# Altium project balancerTest.PrjPCB
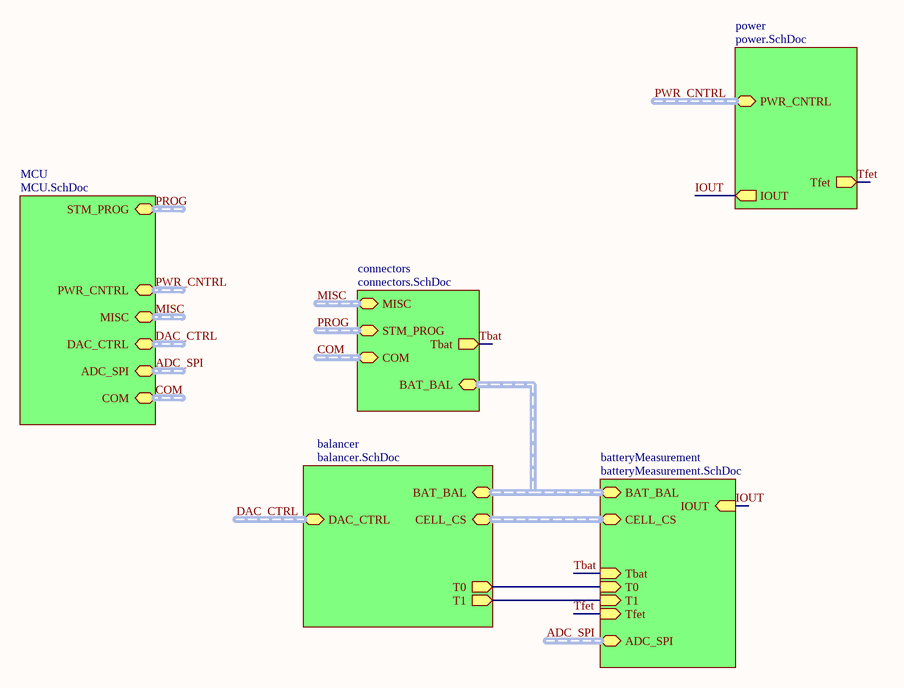
[diagram p0: balancerTest.SchDoc]
6 sheets, 158 parts. Net scope: hierarchical (ports join the sheet entries above them; power ports are global).
Board file: smart_bms.PcbDoc
Sheets:
  balancerTest.SchDoc
    MCU = MCU.SchDoc
    connectors = connectors.SchDoc
    balancer = balancer.SchDoc
    power = power.SchDoc
    batteryMeasurement = batteryMeasurement.SchDoc

## Sheet balancerTest.SchDoc
size A4

### Sub-sheets
balancer = balancer.SchDoc: BAT_BAL (harness BAT_BAL), CELL_CS (harness CELL_CS), DAC_CTRL (harness DAC_CTRL), T0 (out), T1 (out)
batteryMeasurement = batteryMeasurement.SchDoc: BAT_BAL (harness BAT_BAL), CELL_CS (harness CELL_CS), ADC_SPI (harness ADC_SPI), T0 (in), T1 (in), Tbat (in), IOUT (in), Tfet (in)
connectors = connectors.SchDoc: BAT_BAL (harness BAT_BAL), Tbat (out), MISC (harness MISC), STM_PROG (harness PROGRAMMING), COM (harness COM)
MCU = MCU.SchDoc: MISC (harness MISC), DAC_CTRL (harness DAC_CTRL), ADC_SPI (harness ADC_SPI), PWR_CNTRL (harness PWR_CNTRL), STM_PROG (harness PROGRAMMING), COM (harness COM)
power = power.SchDoc: IOUT (out), Tfet (out), PWR_CNTRL (harness PWR_CNTRL)

### Nets
IOUT: sheet power/IOUT, sheet batteryMeasurement/IOUT
Tbat: sheet connectors/Tbat, sheet batteryMeasurement/Tbat
Tfet: sheet power/Tfet, sheet batteryMeasurement/Tfet
NetRA4_5: sheet balancer/T1, sheet batteryMeasurement/T1
NetRA4_6: sheet balancer/T0, sheet batteryMeasurement/T0

### Buses and harness runs
harness ADC_SPI = sheet batteryMeasurement/ADC_SPI
harness ADC_SPI = sheet MCU/ADC_SPI
harness COM = sheet connectors/COM
harness COM = sheet MCU/COM
harness DAC_CTRL = sheet balancer/DAC_CTRL
harness DAC_CTRL = sheet MCU/DAC_CTRL
harness MISC = sheet connectors/MISC
harness MISC = sheet MCU/MISC
harness PROG = sheet connectors/STM_PROG
harness PROG = sheet MCU/STM_PROG
harness PWR_CNTRL = sheet MCU/PWR_CNTRL
harness PWR_CNTRL = sheet power/PWR_CNTRL
harness sheet balancer/BAT_BAL = sheet batteryMeasurement/BAT_BAL = sheet connectors/BAT_BAL
harness sheet balancer/CELL_CS = sheet batteryMeasurement/CELL_CS

## Sheet MCU.SchDoc
size A4
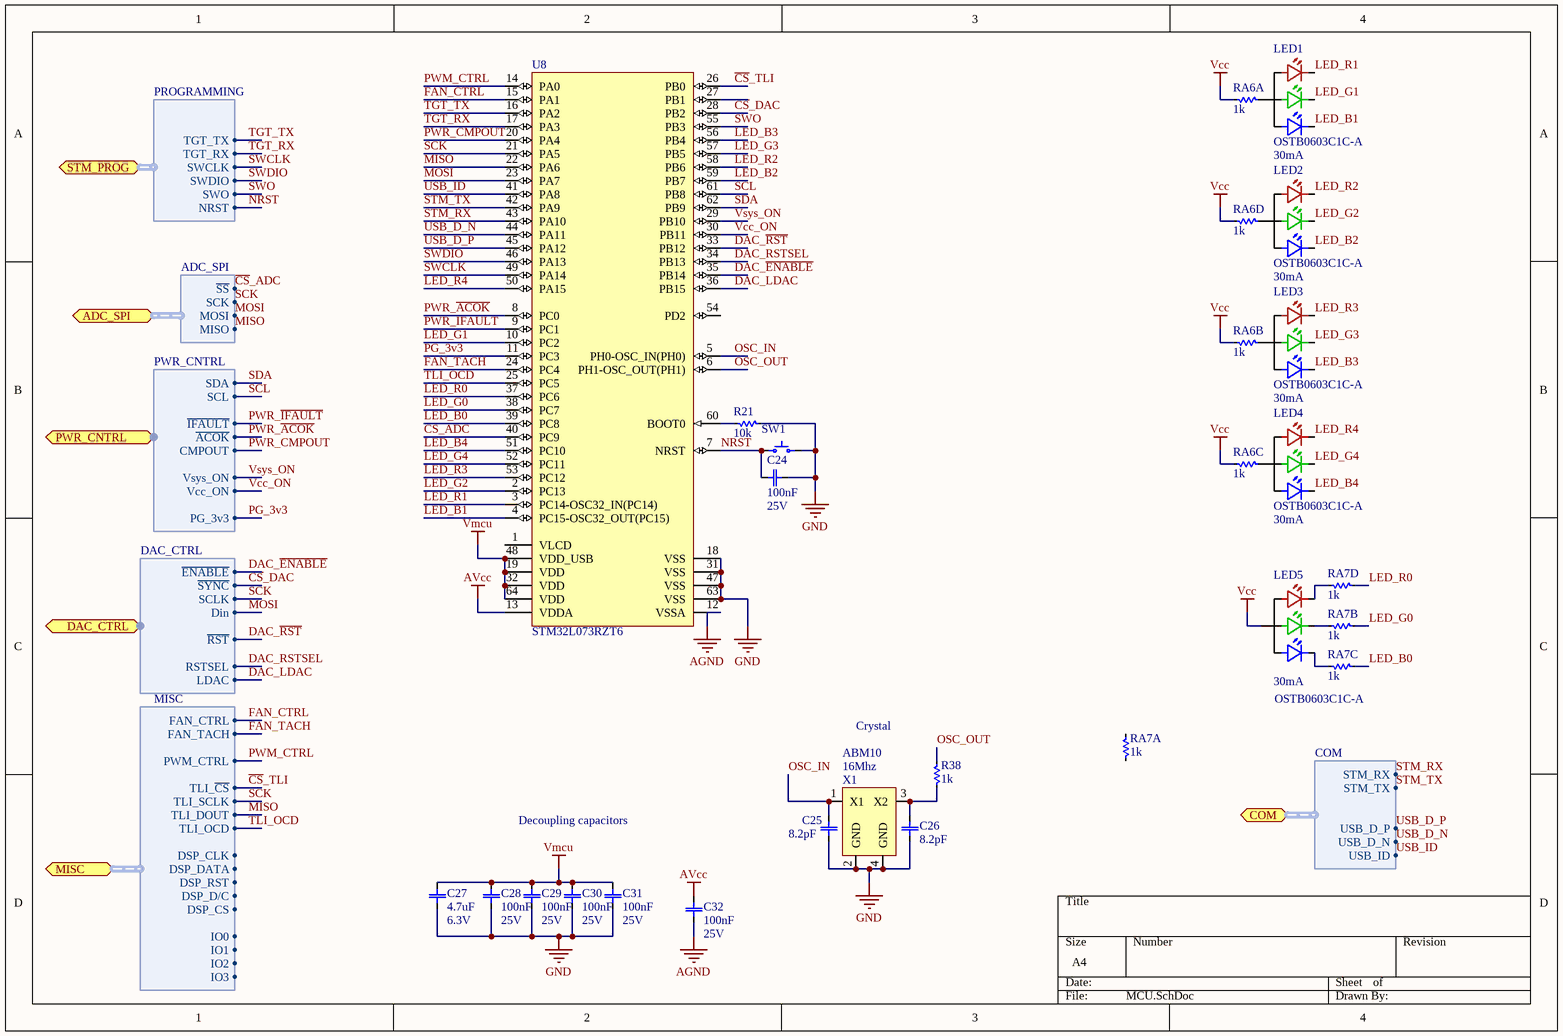
[diagram p1: MCU.SchDoc]

### Parts
C24  Capacitance: 100nF  [CAP0402]  (hidden comment: 25V)
C25  Capacitance: 8.2pF  [CAP0402]  (hidden comment: 25V)
C26  Capacitance: 8.2pF  [CAP0402]  (hidden comment: 25V)
C27  Capacitance: 4.7uF  [CAP0603]  (hidden comment: 6.3V)
C28  Capacitance: 100nF  [CAP0402]  (hidden comment: 25V)
C29  Capacitance: 100nF  [CAP0402]  (hidden comment: 25V)
C30  Capacitance: 100nF  [CAP0402]  (hidden comment: 25V)
C31  Capacitance: 100nF  [CAP0402]  (hidden comment: 25V)
C32  Capacitance: 100nF  [CAP0402]  (hidden comment: 25V)
LED1  OSTB0603C1C-A  Forward current: 30mA  [LED-RGB-1615-CA-OSTB0603C1C-A]
LED2  OSTB0603C1C-A  Forward current: 30mA  [LED-RGB-1615-CA-OSTB0603C1C-A]
LED3  OSTB0603C1C-A  Forward current: 30mA  [LED-RGB-1615-CA-OSTB0603C1C-A]
LED4  OSTB0603C1C-A  Forward current: 30mA  [LED-RGB-1615-CA-OSTB0603C1C-A]
LED5  OSTB0603C1C-A  Forward current: 30mA  [LED-RGB-1615-CA-OSTB0603C1C-A]
R21  Resistance: 10k  [RES0402]  (hidden comment: resistor)
R38  Resistance: 1k  [RES0402]  (hidden comment: resistor)
RA6  Resistance: 1k  [CAC-50P200X100-8L]  (hidden comment: quad_resistor)  (parts A,B,C,D of 4)
RA7  Resistance: 1k  [CAC-50P200X100-8L]  (hidden comment: quad_resistor)  (parts A,B,C,D of 4)
SW1  SPST_PUSHBUTTON  [B3U-1000P]  (value not drawn)
U8  STM32L073RZT6  [STM-LQFP64_N]
X1  ABM10  Frequency: 16Mhz  [XTAL-2.5x2.0]

### Ports
ADC_SPI (harness ADC_SPI), COM (harness COM), DAC_CTRL (harness DAC_CTRL), MISC (harness MISC), PWR_CNTRL (harness PWR_CNTRL), STM_PROG (harness PROGRAMMING)

### Harnesses
ADC_SPI: SCK, MOSI, MISO, ~{SS}
PWR_CNTRL: SDA, SCL, ~{ACOK}, ~{IFAULT}, CMPOUT, Vsys_ON, Vcc_ON, PG_3v3
DAC_CTRL: ~{ENABLE}, ~{SYNC}, SCLK, Din, ~{RST}, RSTSEL, LDAC
MISC: FAN_CTRL, PWM_CTRL, FAN_TACH, DSP_CLK, DSP_DATA, DSP_RST, DSP_D/C, DSP_CS, TLI_~{CS}, TLI_SCLK, TLI_DOUT, TLI_OCD, IO0, IO1, IO2, IO3
PROGRAMMING: NRST, SWDIO, SWCLK, TGT_RX, TGT_TX, SWO
COM: STM_RX, STM_TX, USB_D_P, USB_D_N, USB_ID

### Nets
AGND: C24.2 C25.1 C26.1 C27.1 C28.2 C29.2 C30.2 C31.2 C32.2 R21.2 SW1.2 U8.12(VSSA) U8.18(VSS) U8.31(VSS) U8.47(VSS) U8.63(VSS) X1.2(GND) X1.4(GND)  [also labelled GND]
AVcc: C32.1 U8.13(VDDA)
Vcc: LED5.A RA6.5 RA6.6 RA6.7 RA6.8
Vmcu: C27.2 C28.1 C29.1 C30.1 C31.1 U8.19(VDD) U8.32(VDD) U8.48(VDD_USB) U8.64(VDD)
~{CS}_ADC: U8.40(PC9) ; port ADC_SPI.~{SS}  [project net ADC_SPI.~{SS}]
~{CS}_DAC: U8.28(PB2) ; port DAC_CTRL.~{SYNC}
~{CS}_TLI: U8.26(PB0) ; port MISC.TLI_~{CS}
DAC_~{ENABLE}: U8.35(PB14) ; port DAC_CTRL.~{ENABLE}  [project net DAC_CTRL.~{ENABLE}]
DAC_LDAC: U8.36(PB15) ; port DAC_CTRL.LDAC  [project net DAC_CTRL.LDAC]
DAC_~{RST}: U8.33(PB12) ; port DAC_CTRL.~{RST}  [project net DAC_CTRL.~{RST}]
DAC_RSTSEL: U8.34(PB13) ; port DAC_CTRL.RSTSEL  [project net DAC_CTRL.RSTSEL]
FAN_CTRL: U8.15(PA1) ; port MISC.FAN_CTRL
FAN_TACH: U8.24(PC4) ; port MISC.FAN_TACH
LED_B0: RA7.5 U8.39(PC8)
LED_B1: LED1.B(Blue) U8.4(PC15-OSC32_OUT(PC15))
LED_B2: LED2.B(Blue) U8.59(PB7)
LED_B3: LED3.B(Blue) U8.56(PB4)
LED_B4: LED4.B(Blue) U8.51(PC10)
LED_G0: RA7.6 U8.38(PC7)
LED_G1: LED1.G(Green) U8.10(PC2)
LED_G2: LED2.G(Green) U8.2(PC13)
LED_G3: LED3.G(Green) U8.57(PB5)
LED_G4: LED4.G(Green) U8.52(PC11)
LED_R0: RA7.7 U8.37(PC6)
LED_R1: LED1.R(Red) U8.3(PC14-OSC32_IN(PC14))
LED_R2: LED2.R(Red) U8.58(PB6)
LED_R3: LED3.R(Red) U8.53(PC12)
LED_R4: LED4.R(Red) U8.50(PA15)
MISO: U8.22(PA6) ; port ADC_SPI.MISO, port MISC.TLI_DOUT  [project net ADC_SPI.MISO]
MOSI: U8.23(PA7) ; port ADC_SPI.MOSI, port DAC_CTRL.Din  [project net ADC_SPI.MOSI]
NRST: C24.1 SW1.1 U8.7(NRST) ; port STM_PROG.NRST
OSC_IN: C25.2 U8.5(PH0-OSC_IN(PH0)) X1.1(X1)
OSC_OUT: R38.2 U8.6(PH1-OSC_OUT(PH1))
PG_3v3: U8.11(PC3) ; port PWR_CNTRL.PG_3v3
PWM_CTRL: U8.14(PA0) ; port MISC.PWM_CTRL  [project net MISC.PWM_CTRL]
PWR_~{ACOK}: U8.8(PC0) ; port PWR_CNTRL.~{ACOK}  [project net ~{ACOK}]
PWR_CMPOUT: U8.20(PA4) ; port PWR_CNTRL.CMPOUT  [project net CMPOUT]
PWR_~{IFAULT}: U8.9(PC1) ; port PWR_CNTRL.~{IFAULT}  [project net ~{IFAULT}]
SCK: U8.21(PA5) ; port ADC_SPI.SCK, port DAC_CTRL.SCLK, port MISC.TLI_SCLK  [project net ADC_SPI.SCK]
SCL: U8.61(PB8) ; port PWR_CNTRL.SCL  [project net PWR_CNTRL.SCL]
SDA: U8.62(PB9) ; port PWR_CNTRL.SDA  [project net PWR_CNTRL.SDA]
STM_RX: U8.43(PA10) ; port COM.STM_RX  [project net COM.STM_RX]
STM_TX: U8.42(PA9) ; port COM.STM_TX  [project net COM.STM_TX]
SWCLK: U8.49(PA14) ; port STM_PROG.SWCLK  [project net PROG.SWCLK]
SWDIO: U8.46(PA13) ; port STM_PROG.SWDIO  [project net PROG.SWDIO]
SWO: U8.55(PB3) ; port STM_PROG.SWO  [project net PROG.SWO]
TGT_RX: U8.17(PA3) ; port STM_PROG.TGT_RX  [project net PROG.TGT_RX]
TGT_TX: U8.16(PA2) ; port STM_PROG.TGT_TX  [project net PROG.TGT_TX]
TLI_OCD: U8.25(PC5) ; port MISC.TLI_OCD  [project net MISC.TLI_OCD]
USB_D_N: U8.44(PA11) ; port COM.USB_D_N  [project net COM.USB_D_N]
USB_D_P: U8.45(PA12) ; port COM.USB_D_P  [project net COM.USB_D_P]
USB_ID: U8.41(PA8) ; port COM.USB_ID  [project net COM.USB_ID]
Vcc_ON: U8.30(PB11) ; port PWR_CNTRL.Vcc_ON  [project net PWR_CNTRL.Vcc_ON]
Vsys_ON: U8.29(PB10) ; port PWR_CNTRL.Vsys_ON  [project net PWR_CNTRL.Vsys_ON]
NetC26_2: C26.2 R38.1 X1.3(X2)
NetLED1_A: LED1.A RA6.1
NetLED2_A: LED2.A RA6.2
NetLED3_A: LED3.A RA6.3
NetLED4_A: LED4.A RA6.4
NetLED5_B: LED5.B(Blue) RA7.4
NetLED5_G: LED5.G(Green) RA7.3
NetLED5_R: LED5.R(Red) RA7.2
NetR21_1: R21.1 U8.60(BOOT0)

Not connected (* = marked no-connect by the designer): RA7 1 8; U8 1(VLCD) 27(PB1) 54(PD2)

### Notes on the sheet
- Crystal
- Decoupling capacitors

### Library data of the parts
C24-C32 = capacitor: Tolerance: 10%; Dielectric: X5R
  C24-C26 C28-C32: Voltage: 25V
  C27: Voltage: 6.3V
LED1-LED5 = RGB-LED-CA: pin to pad: A>1 B>3 G>4 R>2; Vred: 2.0V; Vgreen: 2.6V; Vblue: 2.8V
R21 R38 = resistor: Power: 0.063W; Tolerance: 1%
SW1 = SPST_PUSHBUTTON: Standard 2-contact pushbutton; Max voltage: 24V; Max current: 50mA
U8 = CMP-1546-00073-1: Ultra-Low-Power ARM Cortex-M0+ MCU, 192 KB Flash, 20 KB Internal RAM, 51 I/Os, 64-Pin LQFP, -40 to 85 degC, Tray; Internal RAM Size (kB): 20; Data E2PROM nom (B): 6144; FLASH Size (Prog) (kB): 192; Operating Frequency(F) (Processor speed) (MHz): 32; D/A Converter: 2; I/Os (High Current): 51; Supply Voltage(Vcc) min (V): 1.8; ComponentLink1Description: Manufacturer URL; ComponentLink2Description: Datasheet; DatasheetVersion: Rev. 2; Mounting Technology: Surface Mount; Package Description: 64-Pin Low-profile Quad Flat Package, Body 10 x 10 mm, Pitch 0.5 mm; ComponentLink2URL: http://www.st.com/st-web-ui/static/active/en/resource/technical/document/datasheet/DM00141036.pdf; Core: ARM Cortex-M0+; Packing: Tray; ComponentLink1URL: http://www.st.com/; Package Reference: LQFP64
X1 = XTAL-4pin: 4pin crystal with 2 GND pins; Stability: 20ppm; Load capacitance: 10pF; Shunt capacitance: 7pF

## Sheet connectors.SchDoc
size A4
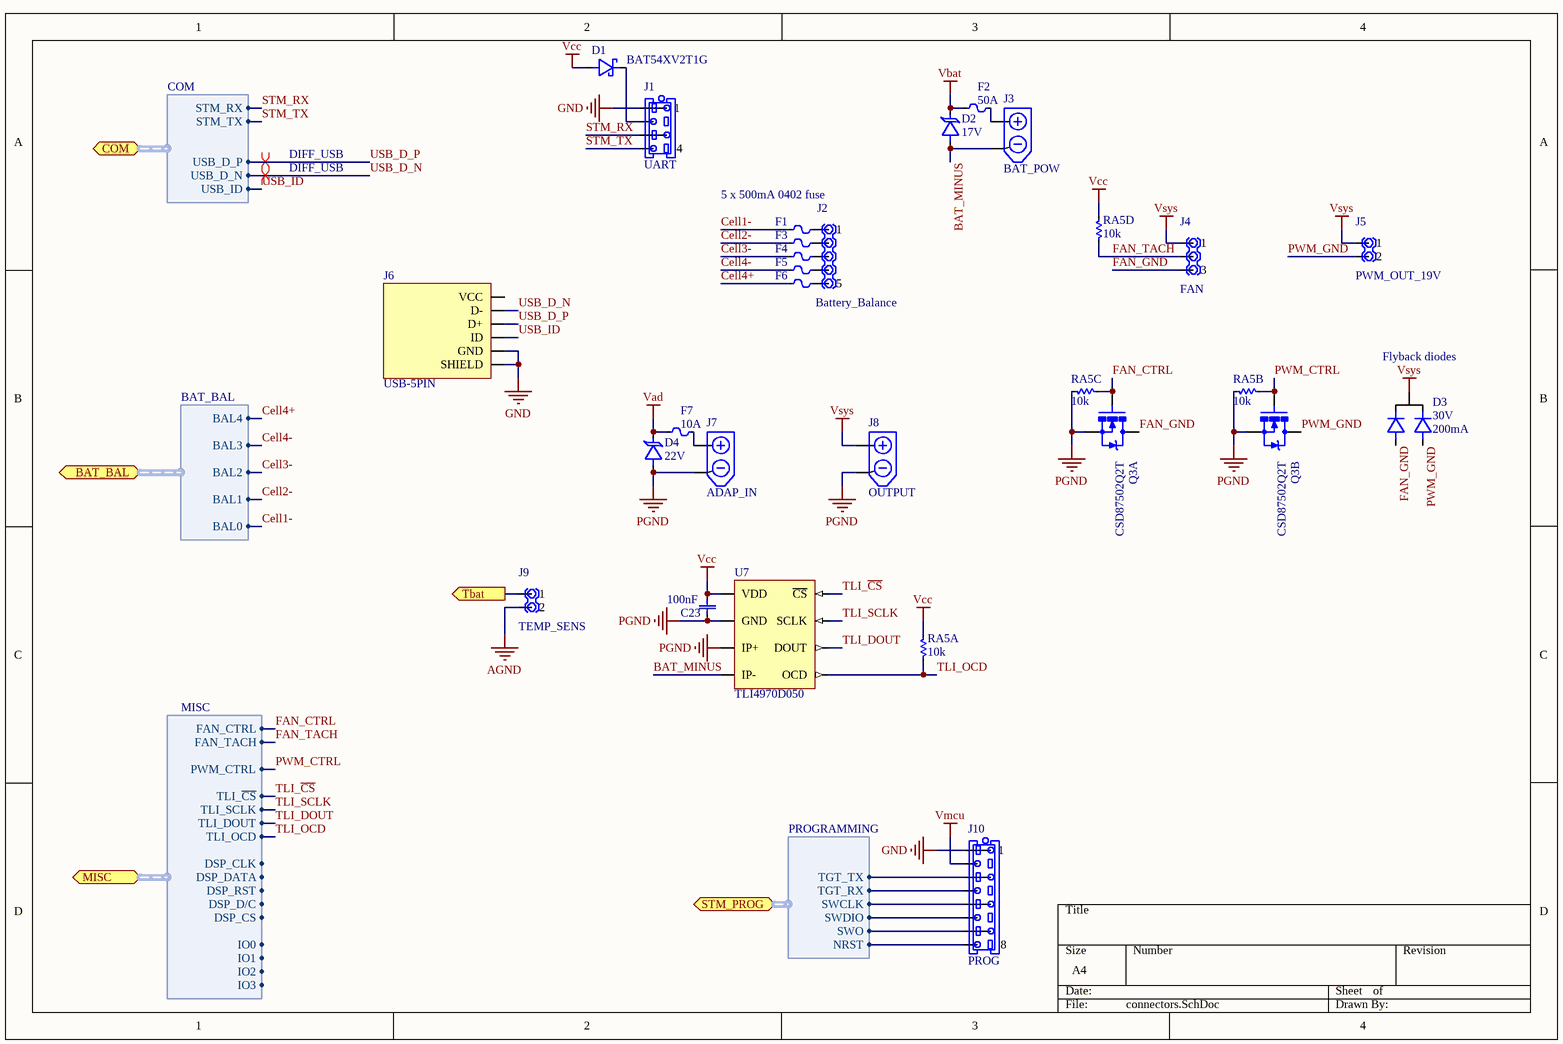
[diagram p2: connectors.SchDoc]

### Parts
C23  Capacitance: 100nF  [CAP0402]  (hidden comment: 0nF)
D1  BAT54XV2T1G  [SOD523]
D2  Reverse stand-off voltage: 17V  [SOD123W]  (hidden comment: PTVS17VS1UR)
D3  Reverse voltage: 30V  Forward current: 200mA  [SOT65P210X110-3L]  (hidden comment: BAT54CWT1G)
D4  Reverse stand-off voltage: 22V  [SOD123W]  (hidden comment: PTVS22VS1UR)
F1  fuse  [FUSE-0402]  (value not drawn)
F2  Rated current: 50A  [FUSE-1206]  (hidden comment: fuse)
F3  fuse  [FUSE-0402]  (value not drawn)
F4  fuse  [FUSE-0402]  (value not drawn)
F5  fuse  [FUSE-0402]  (value not drawn)
F6  fuse  [FUSE-0402]  (value not drawn)
F7  Rated current: 10A  [FUSE-1206]  (hidden comment: fuse)
J1  UART  [MICRO-MATCH-4]
J2  Battery_Balance  [JST-XH-5-TOP]
J3  BAT_POW  [XT60_male]
J4  FAN  [Pin Header 1x3 TH Pitch 2.54mm]
J5  PWM_OUT_19V  [Pin Header 1x2 TH Pitch 2.54mm]
J6  USB-5PIN  [USB-B-MICRO-473460001]
J7  ADAP_IN  [XT60_male]
J8  OUTPUT  [XT60_male]
J9  TEMP_SENS  [Pin Header 1x2 TH Pitch 2.54mm]
J10  PROG  [MICRO-MATCH-8]
Q3  CSD87502Q2T  [SON65P200X80_HS-7L_DUALFET]  (parts A,B of 2)
RA5  Resistance: 10k  [CAC-50P200X100-8L]  (hidden comment: quad_resistor)  (parts A,B,C,D of 4)
U7  TLI4970D050  [PG-TISON-8-1]

### Ports
BAT_BAL (harness BAT_BAL), COM (harness COM), MISC (harness MISC), STM_PROG (harness PROGRAMMING), Tbat (out)

### Harnesses
BAT_BAL: BAL0, BAL1, BAL2, BAL3, BAL4
MISC: FAN_CTRL, PWM_CTRL, FAN_TACH, DSP_CLK, DSP_DATA, DSP_RST, DSP_D/C, DSP_CS, IO0, TLI_~{CS}, TLI_SCLK, TLI_DOUT, TLI_OCD, IO1, IO2, IO3
PROGRAMMING: NRST, SWDIO, SWCLK, TGT_RX, TGT_TX, SWO
COM: STM_RX, STM_TX, USB_D_P, USB_D_N, USB_ID

### Nets
AGND: J1.1 J6.5(GND) J6.6(SHIELD) J9.2 J10.1  [also labelled GND]
PGND: C23.1 D4.A(Anode) J7.1(-) J8.1(-) Q3.S1 Q3.S2 RA5.5 RA5.6 U7.1(GND) U7.7(IP+)
Vad: D4.C(Cathode) F7.1
Vbat: D2.C(Cathode) F2.1  [project net SRN]
Vcc: C23.2 D1.A(Anode) RA5.7 RA5.8 U7.2(VDD)
Vmcu: J10.2
Vsys: D3.C(Cathode) J4.1 J5.1 J8.2(+)
BAT_MINUS: D2.A(Anode) J3.1(-) U7.8(IP-)
Cell1-: F1.1 ; port BAT_BAL.BAL0
Cell2-: F3.1 ; port BAT_BAL.BAL1
Cell3-: F4.1 ; port BAT_BAL.BAL2
Cell4+: F6.1 ; port BAT_BAL.BAL4
Cell4-: F5.1 ; port BAT_BAL.BAL3
FAN_CTRL: Q3.G1 RA5.4 ; port MISC.FAN_CTRL
FAN_GND: D3.A1(Anode1) J4.3 Q3.D1
FAN_TACH: J4.2 RA5.2 ; port MISC.FAN_TACH
NRST: J10.8 ; port STM_PROG.NRST
PROG.SWCLK: J10.5 ; port STM_PROG.SWCLK
PROG.SWDIO: J10.6 ; port STM_PROG.SWDIO
PROG.SWO: J10.7 ; port STM_PROG.SWO
PROG.TGT_RX: J10.4 ; port STM_PROG.TGT_RX
PROG.TGT_TX: J10.3 ; port STM_PROG.TGT_TX
PWM_CTRL: Q3.G2 RA5.3 ; port MISC.PWM_CTRL  [project net MISC.PWM_CTRL]
PWM_GND: D3.A2(Anode2) J5.2 Q3.D2
STM_RX: J1.3 ; port COM.STM_RX  [project net COM.STM_RX]
STM_TX: J1.4 ; port COM.STM_TX  [project net COM.STM_TX]
Tbat: J9.1 ; port Tbat
TLI_~{CS}: U7.5(~{CS}) ; port MISC.TLI_~{CS}  [project net ~{CS}_TLI]
TLI_DOUT: U7.3(DOUT) ; port MISC.TLI_DOUT  [project net ADC_SPI.MISO]
TLI_OCD: RA5.1 U7.6(OCD) ; port MISC.TLI_OCD  [project net MISC.TLI_OCD]
TLI_SCLK: U7.4(SCLK) ; port MISC.TLI_SCLK  [project net ADC_SPI.SCK]
USB_D_N: J6.2(D-) ; port COM.USB_D_N  [project net COM.USB_D_N]
USB_D_P: J6.3(D+) ; port COM.USB_D_P  [project net COM.USB_D_P]
USB_ID: J6.4(ID) ; port COM.USB_ID  [project net COM.USB_ID]
NetD1_C: D1.C(Cathode) J1.2
NetF1_2: F1.2 J2.1
NetF2_2: F2.2 J3.2(+)
NetF3_2: F3.2 J2.2
NetF4_2: F4.2 J2.3
NetF5_2: F5.2 J2.4
NetF6_2: F6.2 J2.5
NetF7_2: F7.2 J7.2(+)

Not connected (* = marked no-connect by the designer): J6 1(VCC)

### Layout directives
differential pair; net class DIFF_USB: COM.USB_D_N, COM.USB_D_P

### Notes on the sheet
- 5 x 500mA 0402 fuse
- (near D3) Flyback diodes

### Library data of the parts
C23 = capacitor: Max voltage: 25V; Tolerance: 10%
D1 = Schottky diode: Peak forward current: 1A; Max forward voltage: 0.5V; Reverse voltage: 30V; Forward current: 200mA
D2 = TVS-DIODE: Peak pulse power dissipation: 400W; Clamping voltage: 27.6
D3 = DUAL-DIODE-CC: pin to pad: A1>1 A2>2 C>3; Peak forward current: 600mA; Max forward voltage: 0.5V
D4 = TVS-DIODE: Peak pulse power dissipation: 400W; Clamping voltage: 35.5V
F1 F3-F6 = fuse: Power: 0.063W; Rated voltage DC: 24V; Blow characteristic: Slow blow; Rated voltage AC: 12V; Breaking current: 2A; Rated current: 500mA
F2 F7 = fuse: Power: 0.063W; Rated voltage DC: 24V; Blow characteristic: Slow blow; Rated voltage AC: 12V; Breaking current: 2A
J1 = MICRO-MATCH-4
J2 = HEADER-5
J3 J7 J8 = XT60
J4 = HEADER-3
J5 J9 = HEADER-2
J6 = USB-5PIN: pin to pad: 6>SHLD
J10 = MICRO-MATCH-8
Q3 = DUAL-NFET: PROD_ID: IC-08089
U7 = TLI4970: High precision miniature coreless magnetic current sensor for AC and DC  measurements with digital interface and fast overcurrent detection; Measurement range: ±50A

## Sheet balancer.SchDoc
size A4
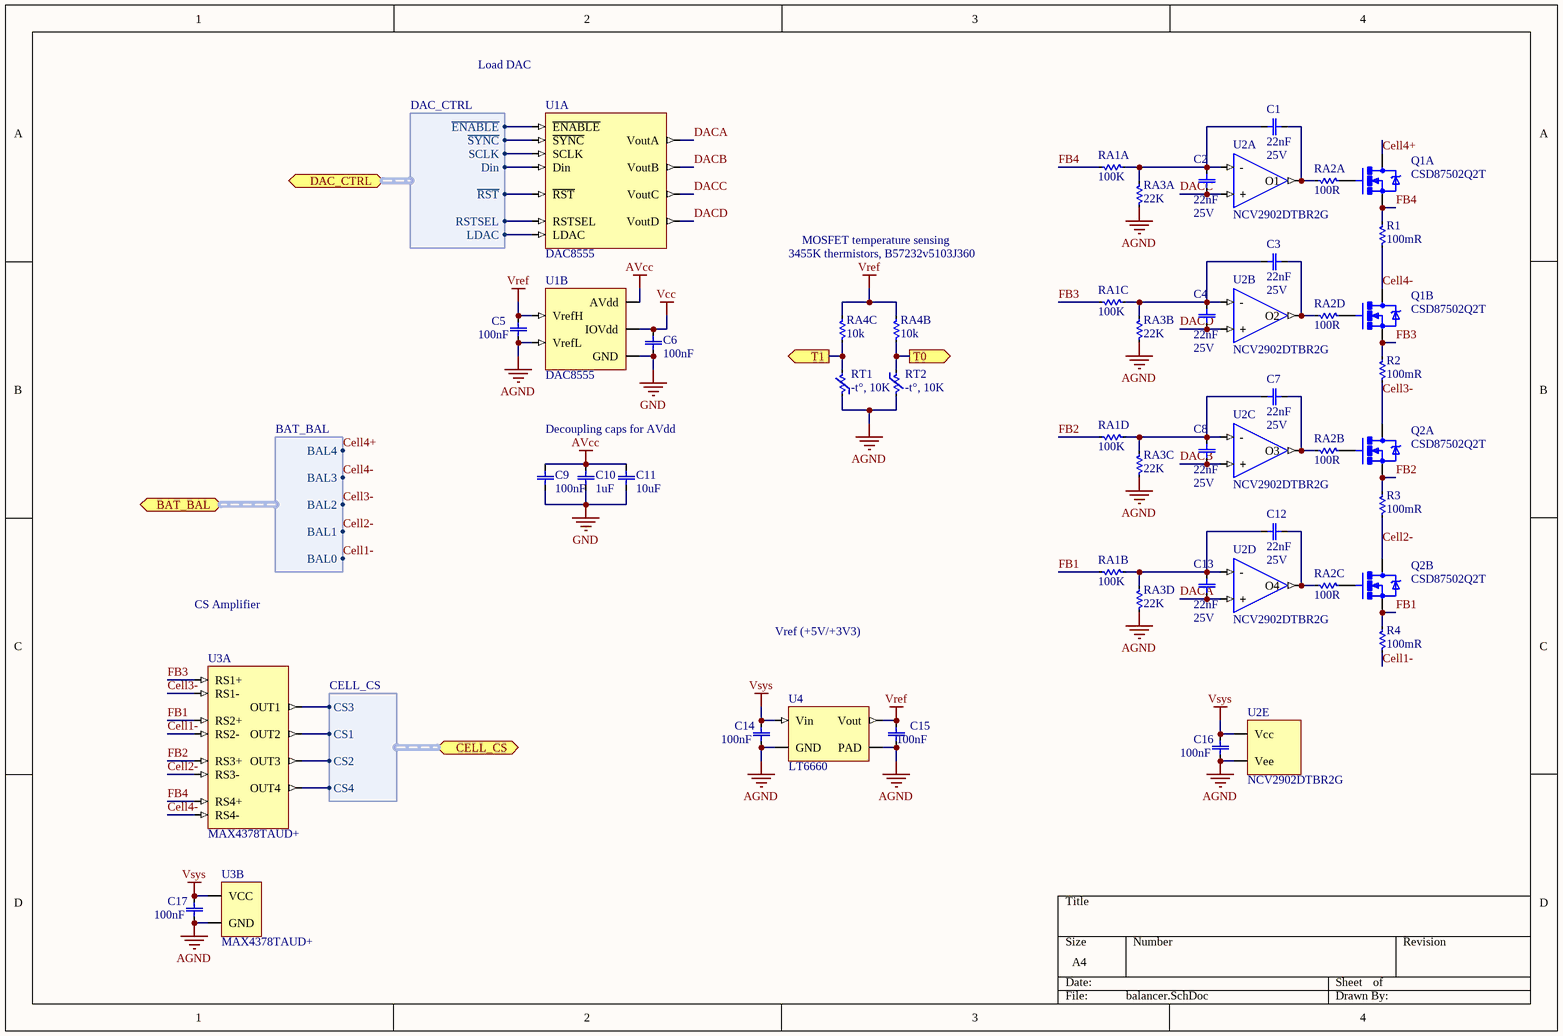
[diagram p3: balancer.SchDoc]

### Parts
C1  Capacitance: 22nF  [CAP0402]  (hidden comment: 25V)
C2  Capacitance: 22nF  [CAP0402]  (hidden comment: 25V)
C3  Capacitance: 22nF  [CAP0402]  (hidden comment: 25V)
C4  Capacitance: 22nF  [CAP0402]  (hidden comment: 25V)
C5  100nF  [CAP0402]
C6  100nF  [CAP0402]
C7  Capacitance: 22nF  [CAP0402]  (hidden comment: 25V)
C8  Capacitance: 22nF  [CAP0402]  (hidden comment: 25V)
C9  100nF  [CAP0402]
C10  1uF  [CAP0603]
C11  10uF  [CAP0603]
C12  Capacitance: 22nF  [CAP0402]  (hidden comment: 25V)
C13  Capacitance: 22nF  [CAP0402]  (hidden comment: 25V)
C14  100nF  [CAP0402]
C15  100nF  [CAP0402]
C16  100nF  [CAP0402]
C17  100nF  [CAP0402]
Q1  CSD87502Q2T  [SON65P200X80_HS-7L_DUALFET]  (parts A,B of 2)
Q2  CSD87502Q2T  [SON65P200X80_HS-7L_DUALFET]  (parts A,B of 2)
R1  100mR  [RES0402]
R2  100mR  [RES0402]
R3  100mR  [RES0402]
R4  100mR  [RES0402]
RA1  100K  [CAC-80P319X159-8M]  (parts A,B,C,D of 4)
RA2  100R  [CAC-50P200X100-8L]  (parts A,B,C,D of 4)
RA3  22K  [CAC-80P319X159-8M]  (parts A,B,C,D of 4)
RA4  Resistance: 10k  [CAC-50P200X100-8L]  (hidden comment: quad_resistor)  (parts B,C of 4)
RT1  -t°, 10K  [RES0402]
RT2  -t°, 10K  [RES0402]
U1  DAC8555  [TSOP65P640X120-16L]  (parts A,B of 2)
U2  NCV2902DTBR2G  [TSOP65P640X120-14L]  (parts A,B,C,D,E of 5)
U3  MAX4378TAUD+  [TSOP65P640X120-14L]  (parts A,B of 2)
U4  LT6660  [DFN50P200X200X75_4L_EP]

### Ports
BAT_BAL (harness BAT_BAL), CELL_CS (harness CELL_CS), DAC_CTRL (harness DAC_CTRL), T0 (out), T1 (out)

### Harnesses
BAT_BAL: BAL0, BAL1, BAL2, BAL3, BAL4
CELL_CS: CS3, CS1, CS2, CS4
DAC_CTRL: ~{ENABLE}, ~{SYNC}, SCLK, Din, ~{RST}, RSTSEL, LDAC

### Nets
AGND: C5.1 C6.1 C9.1 C10.1 C11.1 C14.2 C15.1 C16.2 C17.2 RA3.1 RA3.2 RA3.3 RA3.4 RT1.1 RT2.2 U1.5(VrefL) U1.6(GND) U2.11(Vee) U3.11(GND) U4.2(GND) U4.4(PAD)  [also labelled GND]
AVcc: C9.2 C10.2 C11.2 U1.4(AVdd)
Vcc: C6.2 U1.12(IOVdd)
Vref: C5.2 C15.2 RA4.3 RA4.4 U1.3(VrefH) U4.1(Vout)
Vsys: C14.1 C16.1 C17.1 U2.4(Vcc) U3.4(VCC) U4.3(Vin)
ADC_SPI.MOSI: U1.11(Din) ; port DAC_CTRL.Din
ADC_SPI.SCK: U1.10(SCLK) ; port DAC_CTRL.SCLK
~{CS}_DAC: U1.9(~{SYNC}) ; port DAC_CTRL.~{SYNC}
Cell1-: R4.2 U3.6(RS2-) ; port BAT_BAL.BAL0
Cell2-: Q2.D2 R3.2 U3.9(RS3-) ; port BAT_BAL.BAL1
Cell3-: Q2.D1 R2.2 U3.2(RS1-) ; port BAT_BAL.BAL2
Cell4+: Q1.D1 ; port BAT_BAL.BAL4
Cell4-: Q1.D2 R1.1 U3.13(RS4-) ; port BAT_BAL.BAL3
CS1: U3.7(OUT2) ; port CELL_CS.CS1
CS2: U3.8(OUT3) ; port CELL_CS.CS2
CS3: U3.1(OUT1) ; port CELL_CS.CS3
CS4: U3.14(OUT4) ; port CELL_CS.CS4
DAC_CTRL.~{ENABLE}: U1.15(~{ENABLE}) ; port DAC_CTRL.~{ENABLE}
DAC_CTRL.LDAC: U1.16(LDAC) ; port DAC_CTRL.LDAC
DAC_CTRL.~{RST}: U1.13(~{RST}) ; port DAC_CTRL.~{RST}
DAC_CTRL.RSTSEL: U1.14(RSTSEL) ; port DAC_CTRL.RSTSEL
DACA: C13.1 U1.1(VoutA) U2.12(+)
DACB: C8.1 U1.2(VoutB) U2.10(+)
DACC: C2.1 U1.7(VoutC) U2.3(+)
DACD: C4.1 U1.8(VoutD) U2.5(+)
FB1: Q2.S2 R4.1 RA1.3 U3.5(RS2+)
FB2: Q2.S1 R3.1 RA1.2 U3.10(RS3+)
FB3: Q1.S2 R2.1 RA1.4 U3.3(RS1+)
FB4: Q1.S1 R1.2 RA1.1 U3.12(RS4+)
NetC1_1: C1.1 RA2.1 U2.1(O1)
NetC1_2: C1.2 C2.2 RA1.8 RA3.8 U2.2(-)
NetC3_1: C3.1 RA2.2 U2.7(O2)
NetC3_2: C3.2 C4.2 RA1.5 RA3.6 U2.6(-)
NetC7_1: C7.1 RA2.3 U2.8(O3)
NetC7_2: C7.2 C8.2 RA1.7 RA3.5 U2.9(-)
NetC12_1: C12.1 RA2.4 U2.14(O4)
NetC12_2: C12.2 C13.2 RA1.6 RA3.7 U2.13(-)
NetQ1_G1: Q1.G1 RA2.8
NetQ1_G2: Q1.G2 RA2.7
NetQ2_G1: Q2.G1 RA2.6
NetQ2_G2: Q2.G2 RA2.5
NetRA4_5: RA4.5 RT1.2 ; port T1
NetRA4_6: RA4.6 RT2.1 ; port T0

### Notes on the sheet
- Load DAC
- MOSFET temperature sensing
- 3455K thermistors, B57232v5103J360
- Decoupling caps for AVdd
- CS Amplifier
- Vref (+5V/+3V3)

### Library data of the parts
C1-C4 C7 C8 C12 C13 = capacitor: Tolerance: 10%; Dielectric: X5R; Voltage: 25V
C5 C6 C9-C11 C14-C17 = capacitor
Q1 Q2 = DUAL-MOSFET-N: PROD_ID: IC-08089
R1-R4 = resistor
RA1-RA3 = quad_resistor
RT1 = thermistor: R0: 10R
RT2 = thermistor
U1 = DAC8555: 16-BIT, QUAD CHANNEL, ULTRA-LOW GLITCH, VOLTAGE OUTPUT  DIGITAL-TO-ANALOG CONVERTER
U2 = QUAD_OPAMP
U3 = MAX4378: Quad, High-Side Current-Sense Amplifier with Internal Gain
U4 = LT6660: Tiny Micropower Precision Series References in 2mm × 2mm DFN

## Sheet power.SchDoc
size A4
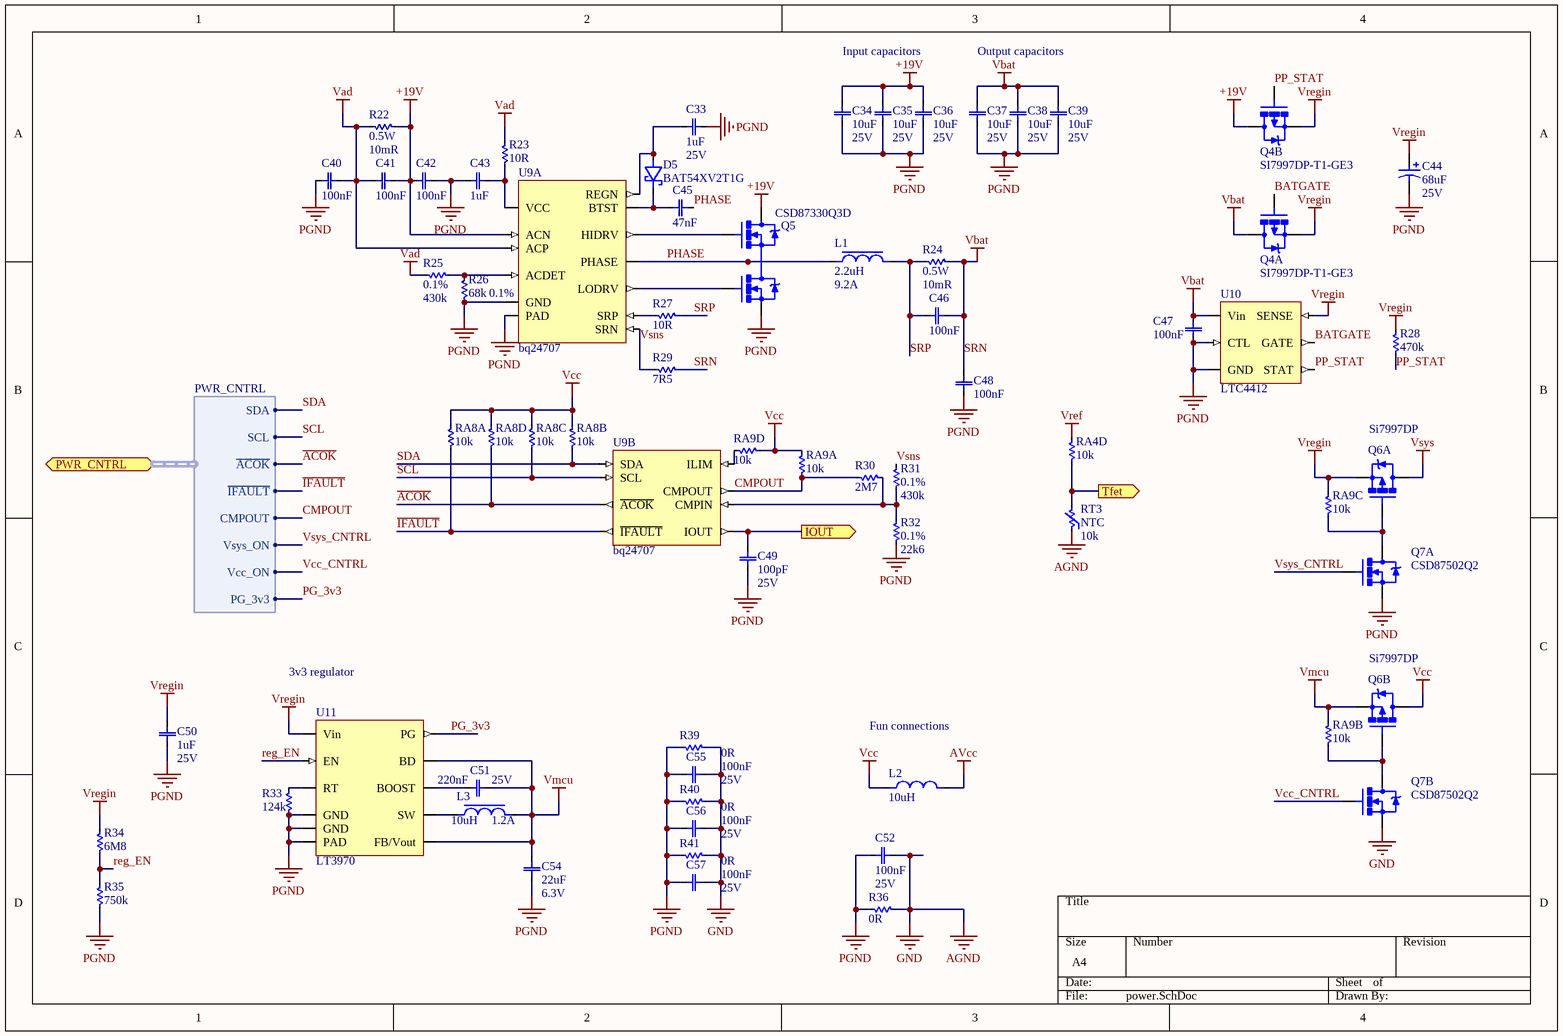
[diagram p4: power.SchDoc]

### Parts
C33  Capacitance: 1uF  [CAP0603]  (hidden comment: 25V)
C34  Capacitance: 10uF  Voltage: 25V  [CAP1206]
C35  Capacitance: 10uF  Voltage: 25V  [CAP1206]
C36  Capacitance: 10uF  Voltage: 25V  [CAP1206]
C37  Capacitance: 10uF  Voltage: 25V  [CAP1206]
C38  Capacitance: 10uF  Voltage: 25V  [CAP1206]
C39  Capacitance: 10uF  Voltage: 25V  [CAP1206]
C40  Capacitance: 100nF  [CAP0402]  (hidden comment: 0nF)
C41  Capacitance: 100nF  [CAP0402]  (hidden comment: 0nF)
C42  Capacitance: 100nF  [CAP0402]  (hidden comment: 0nF)
C43  1uF  [CAP0603]
C44  Capacitance: 68uF  Voltage: 25V  [CAPAE6253X61L]  (hidden comment: cap_pol)
C45  Capacitance: 47nF  [CAP0402]
C46  Capacitance: 100nF  [CAP0402]  (hidden comment: 0nF)
C47  Capacitance: 100nF  [CAP0402]  (hidden comment: 0nF)
C48  Capacitance: 100nF  [CAP0402]  (hidden comment: 0nF)
C49  Capacitance: 100pF  [CAP0402]  (hidden comment: 25V)
C50  Capacitance: 1uF  [CAP0603]  (hidden comment: 25V)
C51  Capacitance: 220nF  [CAP0402]  (hidden comment: 25V)
C52  Capacitance: 100nF  [CAP0402]  (hidden comment: 25V)
C54  Capacitance: 22uF  Voltage: 6.3V  [CAP0805]
C55  Capacitance: 100nF  [CAP0402]  (hidden comment: 25V)
C56  Capacitance: 100nF  [CAP0402]  (hidden comment: 25V)
C57  Capacitance: 100nF  [CAP0402]  (hidden comment: 25V)
D5  BAT54XV2T1G  [SOD523]
L1  Inductance: 2.2uH  Saturation current: 9.2A  [XAL5030-222MEC]  (hidden comment: XAL5030-222MEC)
L2  Inductance: 10uH  [INDC0603]  (hidden comment: chip_inductor)
L3  Inductance: 10uH  Saturation current: 1.2A  [LPS4018]  (hidden comment: LPS4018-333MR)
Q4  SI7997DP-T1-GE3  [PowerPAK SO-8 DUAL]  (parts A,B of 2)
Q5  CSD87330Q3D  [TI_Q3D]
Q6  Si7997DP  [PowerPAK SO-8 DUAL]  (parts A,B of 2)
Q7  CSD87502Q2  [SON65P200X80_HS-7L_DUALFET]  (parts A,B of 2)
R22  Power: 0.5W  Resistance: 10mR  [RES0805]  (hidden comment: 0R)
R23  Resistance: 10R  [RES0603]  (hidden comment: 0R)
R24  Power: 0.5W  Resistance: 10mR  [RES0805]  (hidden comment: 0R)
R25  Tolerance: 0.1%  Resistance: 430k  [RES0402]  (hidden comment: resistor)
R26  Tolerance: 0.1%  Resistance: 68k  [RES0402]  (hidden comment: 0R)
R27  Resistance: 10R  [RES0402]  (hidden comment: resistor)
R28  Resistance: 470k  [RES0402]  (hidden comment: resistor)
R29  Resistance: 7R5  [RES0402]  (hidden comment: resistor)
R30  Resistance: 2M7  [RES0402]  (hidden comment: resistor)
R31  Tolerance: 0.1%  Resistance: 430k  [RES0402]  (hidden comment: resistor)
R32  Tolerance: 0.1%  Resistance: 22k6  [RES0402]  (hidden comment: resistor)
R33  Resistance: 124k  [RES0402]  (hidden comment: resistor)
R34  Resistance: 6M8  [RES0402]  (hidden comment: resistor)
R35  Resistance: 750k  [RES0402]  (hidden comment: resistor)
R36  Resistance: 0R  [RES0402]  (hidden comment: resistor)
R39  Resistance: 0R  [RES0402]  (hidden comment: resistor)
R40  Resistance: 0R  [RES0402]  (hidden comment: resistor)
R41  Resistance: 0R  [RES0402]  (hidden comment: resistor)
RA4  Resistance: 10k  [CAC-50P200X100-8L]  (hidden comment: quad_resistor)  (part D of 4)
RA8  10k  [CAC-50P200X100-8L]  (parts A,B,C,D of 4)
RA9  Resistance: 10k  [CAC-50P200X100-8L]  (hidden comment: quad_resistor)  (parts A,B,C,D of 4)
RT3  Type: NTC  Resistance: 10k  [RES0402]  (hidden comment: thermistor)
U9  bq24707  [QFN50P350X350X100_HS-21L]  (parts A,B of 2)
U10  LTC4412  [SOT95P280X100-6L]
U11  LT3970  [DFN50P200X300X85_HS-11L]

### Ports
IOUT (out), PWR_CNTRL (harness PWR_CNTRL), Tfet (out)

### Harnesses
PWR_CNTRL: SDA, SCL, ~{ACOK}, ~{IFAULT}, CMPOUT, Vsys_ON, Vcc_ON, PG_3v3

### Nets
+19V: C34.2 C35.2 C36.2 C41.2 C42.1 Q4.D2 Q5.D1 R22.2 U9.1(ACN)
AGND: C52.2 C55.2 C56.2 C57.2 Q7.S2 R36.1 R39.2 R40.2 R41.2 RT3.1  [also labelled GND]
AVcc: L2.2
PGND: C33.2 C34.1 C35.1 C36.1 C37.1 C38.1 C39.1 C40.1 C42.2 C43.2 C44.- C47.1 C48.1 C49.1 C50.1 C52.1 C54.2 C55.1 C56.1 C57.1 Q5.S2 Q7.S1 R26.1 R32.1 R33.2 R35.1 R36.2 R39.1 R40.1 R41.1 U9.14(GND) U9.21(PAD) U10.2(GND) U10.3(CTL) U11.4(GND) U11.5(GND) U11.11(PAD)
SRN: C37.2 C38.2 C39.2 C46.2 C47.2 C48.2 Q4.D1 R24.2 R29.2 U10.1(Vin)  [also labelled Vbat]
Vad: C40.2 C41.1 R22.1 R23.1 R25.2 U9.2(ACP)
Vcc: L2.1 Q6.D2 RA8.5 RA8.6 RA8.7 RA8.8 RA9.1 RA9.2
Vmcu: C51.2 C54.1 L3.2 Q6.S2 RA9.3 U11.1(FB/Vout) U11.8(BD)
Vref: RA4.2
Vregin: C44.+ C50.2 Q4.S1 Q4.S2 Q6.S1 R28.2 R34.2 RA9.4 U10.4(SENSE) U11.3(Vin)
Vsys: Q6.D1
~{ACOK}: RA8.2 U9.5(~{ACOK}) ; port PWR_CNTRL.~{ACOK}
BATGATE: Q4.G1 U10.5(GATE)
CMPOUT: R30.1 RA9.8 U9.3(CMPOUT) ; port PWR_CNTRL.CMPOUT
~{IFAULT}: RA8.1 U9.11(~{IFAULT}) ; port PWR_CNTRL.~{IFAULT}
IOUT: C49.2 U9.7(IOUT) ; port IOUT
PG_3v3: U11.9(PG) ; port PWR_CNTRL.PG_3v3
PHASE: C45.2 L1.1 Q5.D2 Q5.S1 U9.19(PHASE)
PP_STAT: Q4.G2 R28.1 U10.6(STAT)
reg_EN: R34.1 R35.2 U11.2(EN)
SCL: RA8.4 U9.9(SCL) ; port PWR_CNTRL.SCL  [project net PWR_CNTRL.SCL]
SDA: RA8.3 U9.8(SDA) ; port PWR_CNTRL.SDA  [project net PWR_CNTRL.SDA]
SRP: C46.1 L1.2 R24.1 R27.2
Tfet: RA4.7 RT3.2 ; port Tfet
Vcc_CNTRL: Q7.G2 ; port PWR_CNTRL.Vcc_ON  [project net PWR_CNTRL.Vcc_ON]
Vsns: R29.1 R31.1 U9.12(SRN)
Vsys_CNTRL: Q7.G1 ; port PWR_CNTRL.Vsys_ON  [project net PWR_CNTRL.Vsys_ON]
NetC33_1: C33.1 D5.A(Anode) U9.16(REGN)
NetC43_1: C43.1 R23.2 U9.20(VCC)
NetC45_1: C45.1 D5.C(Cathode) U9.17(BTST)
NetC51_1: C51.1 U11.7(BOOST)
NetL3_1: L3.1 U11.6(SW)
NetQ5_G1: Q5.G1 U9.18(HIDRV)
NetQ5_G2: Q5.G2 U9.15(LODRV)
NetQ6_G1: Q6.G1 Q7.D1 RA9.5
NetQ6_G2: Q6.G2 Q7.D2 RA9.6
NetR25_1: R25.1 R26.2 U9.6(ACDET)
NetR27_1: R27.1 U9.13(SRP)
NetR30_2: R30.2 R31.2 R32.2 U9.4(CMPIN)
NetR33_1: R33.1 U11.10(RT)
NetRA9_7: RA9.7 U9.10(ILIM)

### Notes on the sheet
- Input capacitors
- Output capacitors
- 3v3 regulator
- Fun connections

### Library data of the parts
C33-C39 C45 C49 C51 C52 C55-C57 = capacitor: Tolerance: 10%; Dielectric: X5R
  C33 C49 C51 C52 C55-C57: Voltage: 25V
C40-C42 C46-C48 = capacitor: Max voltage: 25V; Tolerance: 10%
C43 = capacitor
C44 = cap_pol: Tolerance: 20%; Type: AE
C50 = capacitor: Tolerance: 10%; Dielectric: X7R; Voltage: 25V
C54 = capacitor: Tolerance: 20%; Dielectric: X5R
D5 = Schottky diode: as D1 on sheet connectors
L1 = power_inductor: RMS current: 9.7A; Tolerance: 20%; DC resistance max: 14.5mR
L2 = chip_inductor: Tolerance: 20%; DC resistance max: 1.05ohm; DC current: 250mA; Self resonant frequency: 17MHz
L3 = power_inductor: RMS current: 900mA; Tolerance: 20%; DC resistance max: 200mR
Q4 Q6 = DUAL-PFET
Q5 = BUCKFET: pin to pad: D1>Vin D2>Tgr G1>Tg G2>Bg S1>Vsw S2>Pgnd
Q7 = DUAL-NFET: PROD_ID: IC-08089
R22 R24 = resistor: Tolerance: 1%
R23 = resistor: Power: 0.125W; Tolerance: 5%
R25 R31 R32 = resistor: Power: 0.063W
R26 = resistor: Power: 0,63W
R27-R30 R33-R36 R39-R41 = resistor: Power: 0.063W; Tolerance: 1%
RA8 = quad_resistor
RT3 = thermistor: Beta: 3435K; Min temp: -40C; Max temp: 125C; Power: 60mW; Tolerance: 1%
U9 = bq24707: 1-4 Cell Li+ Battery SMBus Charge Controller With Independent Comparator and Advanced Circuit Protection
U10 = LTC4412: Low Loss PowerPath™ Controller in ThinSOT
U11 = LT3970: 40V, 350mA Step-Down Regulator with 2.5µA Quiescent Current and Integrated Diodes; Output voltage: 3.3V

## Sheet batteryMeasurement.SchDoc
size A4
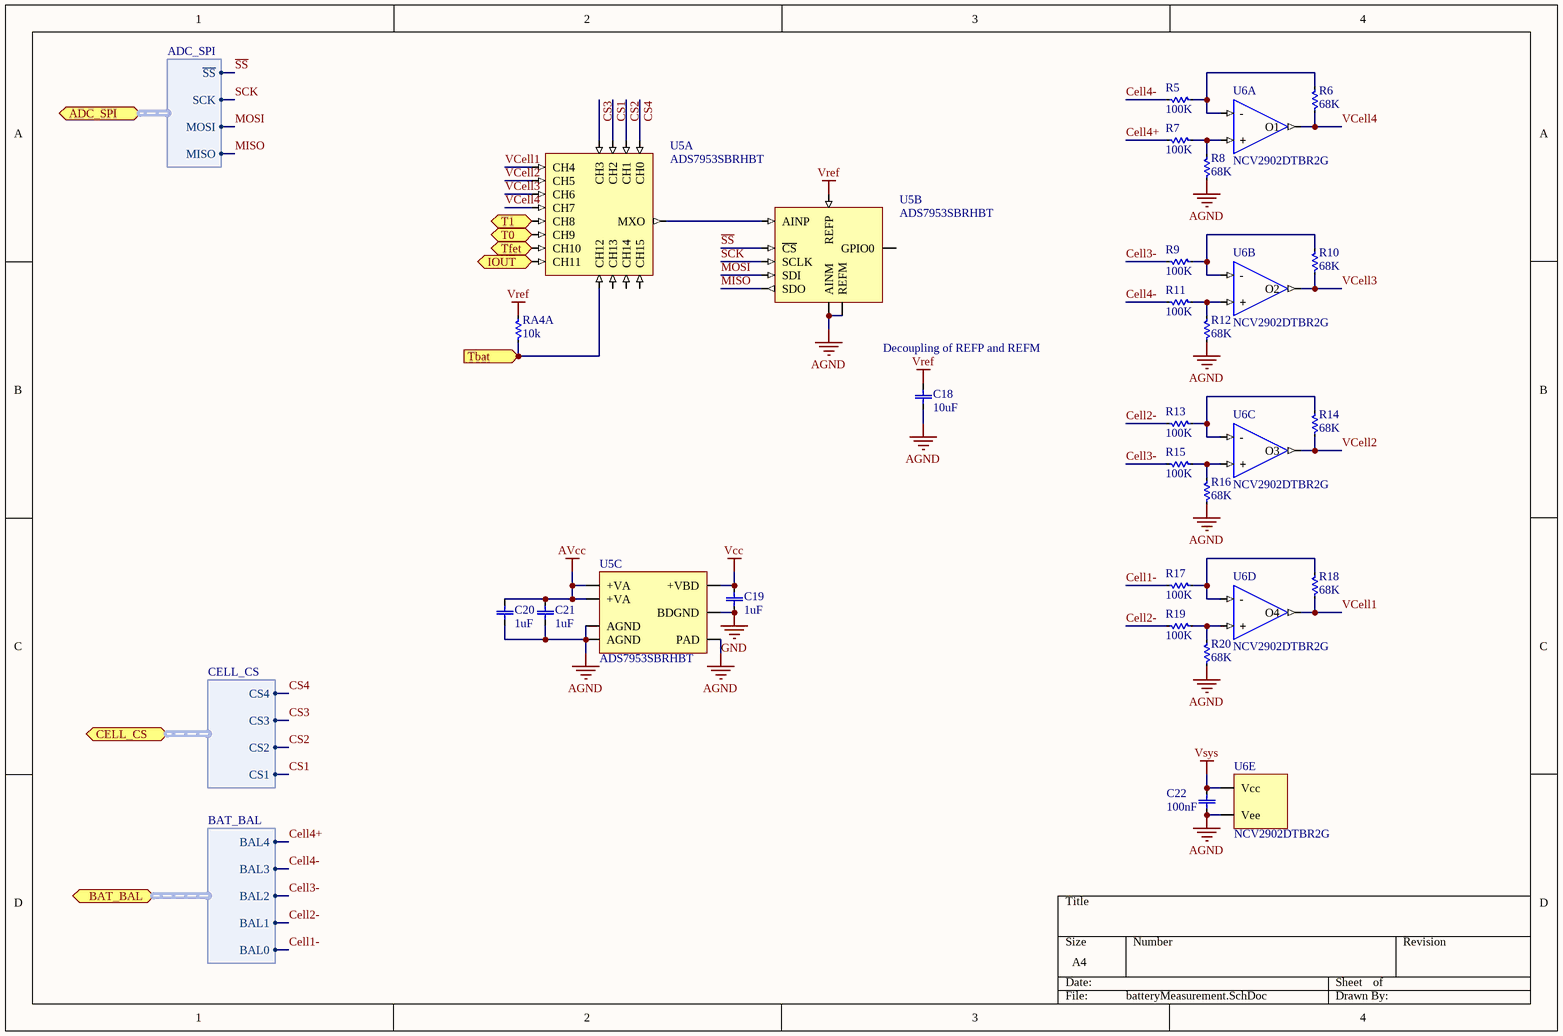
[diagram p5: batteryMeasurement.SchDoc]

### Parts
C18  10uF  [CAP0603]
C19  1uF  [CAP0603]
C20  1uF  [CAP0603]
C21  1uF  [CAP0603]
C22  100nF  [CAP0402]
R5  100K  [RES0402]
R6  68K  [RES0402]
R7  100K  [RES0402]
R8  68K  [RES0402]
R9  100K  [RES0402]
R10  68K  [RES0402]
R11  100K  [RES0402]
R12  68K  [RES0402]
R13  100K  [RES0402]
R14  68K  [RES0402]
R15  100K  [RES0402]
R16  68K  [RES0402]
R17  100K  [RES0402]
R18  68K  [RES0402]
R19  100K  [RES0402]
R20  68K  [RES0402]
RA4  Resistance: 10k  [CAC-50P200X100-8L]  (hidden comment: quad_resistor)  (part A of 4)
U5  ADS7953SBRHBT  [QFN50P500X500X100_HS-33L]  (parts A,B,C of 3)
U6  NCV2902DTBR2G  [TSOP65P640X120-14L]  (parts A,B,C,D,E of 5)

### Ports
ADC_SPI (harness ADC_SPI), BAT_BAL (harness BAT_BAL), CELL_CS (harness CELL_CS), IOUT (in), T0 (in), T1 (in), Tbat (in), Tfet (in)

### Harnesses
BAT_BAL: BAL0, BAL1, BAL2, BAL3, BAL4
CELL_CS: CS1, CS2, CS3, CS4
ADC_SPI: SCK, MOSI, MISO, ~{SS}

### Nets
AGND: C18.1 C19.1 C20.1 C21.1 C22.2 R8.1 R12.1 R16.1 R20.1 U5.1(AGND) U5.4(AINM) U5.22(AGND) U5.27(BDGND) U5.30(REFM) U5.33(PAD) U6.11(Vee)  [also labelled GND]
AVcc: C20.2 C21.2 U5.21(+VA) U5.32(+VA)
Vcc: C19.2 U5.28(+VBD)
Vref: C18.2 RA4.1 U5.31(REFP)
Vsys: C22.1 U6.4(Vcc)
Cell1-: R17.2 ; port BAT_BAL.BAL0
Cell2-: R13.2 R19.2 ; port BAT_BAL.BAL1
Cell3-: R9.2 R15.2 ; port BAT_BAL.BAL2
Cell4+: R7.2 ; port BAT_BAL.BAL4
Cell4-: R5.2 R11.2 ; port BAT_BAL.BAL3
CS1: U5.18(CH2) ; port CELL_CS.CS1
CS2: U5.19(CH1) ; port CELL_CS.CS2
CS3: U5.17(CH3) ; port CELL_CS.CS3
CS4: U5.20(CH0) ; port CELL_CS.CS4
IOUT: U5.9(CH11) ; port IOUT
MISO: U5.26(SDO) ; port ADC_SPI.MISO  [project net ADC_SPI.MISO]
MOSI: U5.25(SDI) ; port ADC_SPI.MOSI  [project net ADC_SPI.MOSI]
~{SS}: U5.23(~{CS}) ; port ADC_SPI.~{SS}  [project net ADC_SPI.~{SS}]
SCK: U5.24(SCLK) ; port ADC_SPI.SCK  [project net ADC_SPI.SCK]
Tbat: RA4.8 U5.8(CH12) ; port Tbat
Tfet: U5.10(CH10) ; port Tfet
VCell1: R18.1 U5.16(CH4) U6.14(O4)
VCell2: R14.1 U5.15(CH5) U6.8(O3)
VCell3: R10.1 U5.14(CH6) U6.7(O2)
VCell4: R6.1 U5.13(CH7) U6.1(O1)
NetR5_1: R5.1 R6.2 U6.2(-)
NetR7_1: R7.1 R8.2 U6.3(+)
NetR9_1: R9.1 R10.2 U6.6(-)
NetR11_1: R11.1 R12.2 U6.5(+)
NetR13_1: R13.1 R14.2 U6.9(-)
NetR15_1: R15.1 R16.2 U6.10(+)
NetR17_1: R17.1 R18.2 U6.13(-)
NetR19_1: R19.1 R20.2 U6.12(+)
NetRA4_5: U5.12(CH8) ; port T1
NetRA4_6: U5.11(CH9) ; port T0
NetU5_2: U5.2(MXO) U5.3(AINP)

Not connected (* = marked no-connect by the designer): U5 5(CH15) 6(CH14) 7(CH13) 29(GPIO0)

### Notes on the sheet
- Decoupling of REFP and REFM

### Library data of the parts
C18-C22 = capacitor
R5-R20 = resistor
U5 = ADS7953RHB: 12-Bit, 1 MSPS, 16-Channel, Single-Ended, MicroPower, Serial Interface ADC
U6 = QUAD_OPAMP

## Nets that join several sheets
AGND: MCU (18 pins), connectors (5 pins), balancer (21 pins), power (10 pins), batteryMeasurement (16 pins)
AVcc: MCU (C32.1 U8.13), balancer (C9.2 C10.2 C11.2 U1.4), power (L2.2), batteryMeasurement (C20.2 C21.2 U5.21 U5.32)
PGND: connectors (10 pins), power (37 pins)
SRN: connectors (D2.C F2.1), power (10 pins)
Vad: connectors (D4.C F7.1), power (6 pins)
Vcc: MCU (5 pins), connectors (5 pins), balancer (C6.2 U1.12), power (8 pins), batteryMeasurement (C19.2 U5.28)
Vmcu: MCU (9 pins), connectors (J10.2), power (7 pins)
Vref: balancer (6 pins), power (RA4.2), batteryMeasurement (C18.2 RA4.1 U5.31)
Vsys: connectors (D3.C J4.1 J5.1 J8.2), balancer (6 pins), power (Q6.D1), batteryMeasurement (C22.1 U6.4)
~{ACOK}: MCU (U8.8), power (RA8.2 U9.5)
ADC_SPI.MISO: MCU (U8.22), connectors (U7.3), batteryMeasurement (U5.26)
ADC_SPI.MOSI: MCU (U8.23), balancer (U1.11), batteryMeasurement (U5.25)
ADC_SPI.~{SS}: MCU (U8.40), batteryMeasurement (U5.23)
ADC_SPI.SCK: MCU (U8.21), connectors (U7.4), balancer (U1.10), batteryMeasurement (U5.24)
~{CS}_DAC: MCU (U8.28), balancer (U1.9)
~{CS}_TLI: MCU (U8.26), connectors (U7.5)
Cell1-: connectors (F1.1), balancer (R4.2 U3.6), batteryMeasurement (R17.2)
Cell2-: connectors (F3.1), balancer (Q2.D2 R3.2 U3.9), batteryMeasurement (R13.2 R19.2)
Cell3-: connectors (F4.1), balancer (Q2.D1 R2.2 U3.2), batteryMeasurement (R9.2 R15.2)
Cell4+: connectors (F6.1), balancer (Q1.D1), batteryMeasurement (R7.2)
Cell4-: connectors (F5.1), balancer (Q1.D2 R1.1 U3.13), batteryMeasurement (R5.2 R11.2)
CMPOUT: MCU (U8.20), power (R30.1 RA9.8 U9.3)
COM.STM_RX: MCU (U8.43), connectors (J1.3)
COM.STM_TX: MCU (U8.42), connectors (J1.4)
COM.USB_D_N: MCU (U8.44), connectors (J6.2)
COM.USB_D_P: MCU (U8.45), connectors (J6.3)
COM.USB_ID: MCU (U8.41), connectors (J6.4)
CS1: balancer (U3.7), batteryMeasurement (U5.18)
CS2: balancer (U3.8), batteryMeasurement (U5.19)
CS3: balancer (U3.1), batteryMeasurement (U5.17)
CS4: balancer (U3.14), batteryMeasurement (U5.20)
DAC_CTRL.~{ENABLE}: MCU (U8.35), balancer (U1.15)
DAC_CTRL.LDAC: MCU (U8.36), balancer (U1.16)
DAC_CTRL.~{RST}: MCU (U8.33), balancer (U1.13)
DAC_CTRL.RSTSEL: MCU (U8.34), balancer (U1.14)
FAN_CTRL: MCU (U8.15), connectors (Q3.G1 RA5.4)
FAN_TACH: MCU (U8.24), connectors (J4.2 RA5.2)
~{IFAULT}: MCU (U8.9), power (RA8.1 U9.11)
IOUT: power (C49.2 U9.7), batteryMeasurement (U5.9)
MISC.PWM_CTRL: MCU (U8.14), connectors (Q3.G2 RA5.3)
MISC.TLI_OCD: MCU (U8.25), connectors (RA5.1 U7.6)
NetRA4_5: balancer (RA4.5 RT1.2), batteryMeasurement (U5.12)
NetRA4_6: balancer (RA4.6 RT2.1), batteryMeasurement (U5.11)
NRST: MCU (C24.1 SW1.1 U8.7), connectors (J10.8)
PG_3v3: MCU (U8.11), power (U11.9)
PROG.SWCLK: MCU (U8.49), connectors (J10.5)
PROG.SWDIO: MCU (U8.46), connectors (J10.6)
PROG.SWO: MCU (U8.55), connectors (J10.7)
PROG.TGT_RX: MCU (U8.17), connectors (J10.4)
PROG.TGT_TX: MCU (U8.16), connectors (J10.3)
PWR_CNTRL.SCL: MCU (U8.61), power (RA8.4 U9.9)
PWR_CNTRL.SDA: MCU (U8.62), power (RA8.3 U9.8)
PWR_CNTRL.Vcc_ON: MCU (U8.30), power (Q7.G2)
PWR_CNTRL.Vsys_ON: MCU (U8.29), power (Q7.G1)
Tbat: connectors (J9.1), batteryMeasurement (RA4.8 U5.8)
Tfet: power (RA4.7 RT3.2), batteryMeasurement (U5.10)